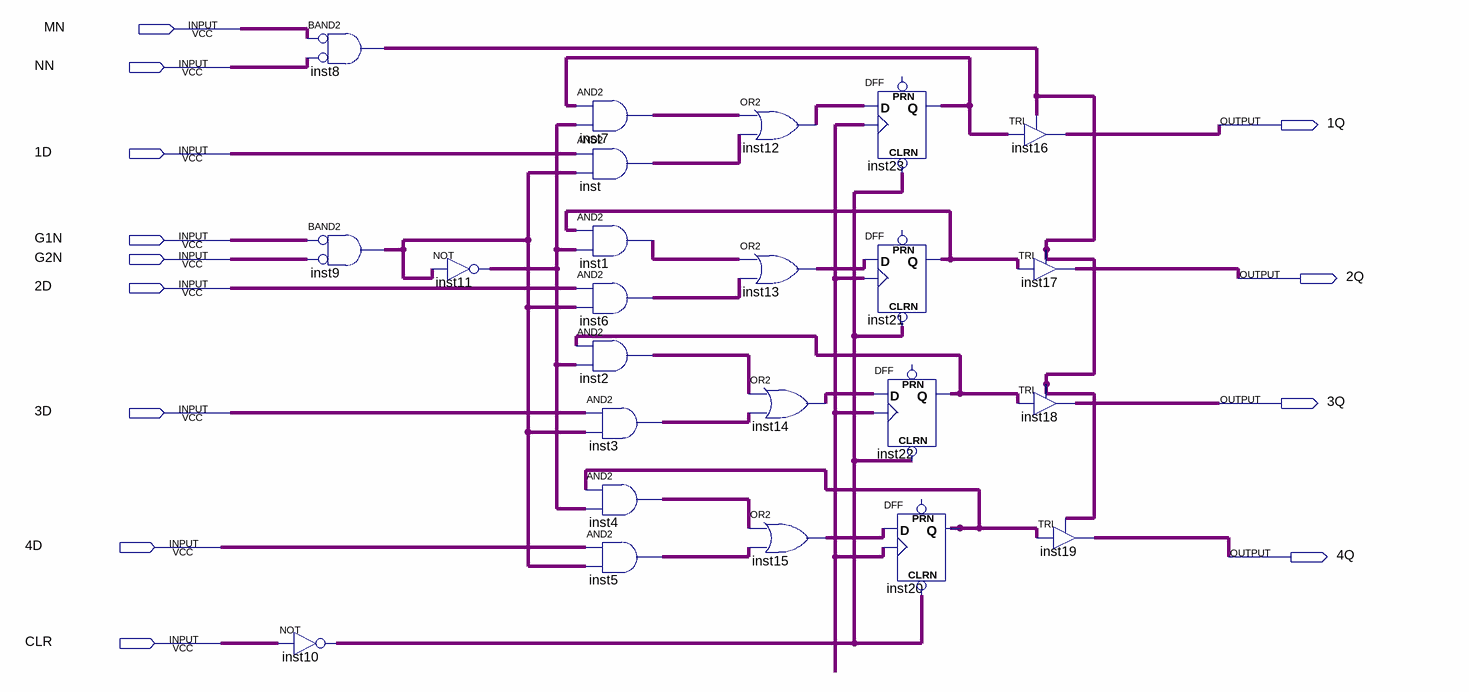
[diagram p0: schematic sheet]
// Quartus schematic Contador.bdf as structural Verilog: 24 symbols, 13 pins
module Contador (
  input  MN,
  input  NN,
  input  \1D ,
  input  G1N,
  input  G2N,
  input  \2D ,
  input  \3D ,
  input  \4D ,
  input  CLR,
  output \1Q ,
  output \2Q ,
  output \3Q ,
  output \4Q 
);

  wire inst1_out, inst2_out, inst3_out, inst4_out, inst5_out, inst6_out, inst7_out, inst8_out, inst9_out,
       inst10_out, inst11_out, inst12_out, inst13_out, inst14_out, inst15_out, inst20_q, inst21_q, inst22_q,
       inst23_q, inst_out, undriven;

  and inst8 (inst8_out, ~MN, ~NN);  // BAND2
  and inst9 (inst9_out, ~G1N, ~G2N);  // BAND2
  not inst10 (inst10_out, CLR);
  not inst11 (inst11_out, inst9_out);
  and inst7 (inst7_out, inst23_q, inst11_out);
  and inst (inst_out, \1D , inst9_out);
  and inst1 (inst1_out, inst21_q, inst11_out);
  and inst6 (inst6_out, \2D , inst9_out);
  and inst2 (inst2_out, inst22_q, inst11_out);
  and inst3 (inst3_out, \3D , inst9_out);
  and inst4 (inst4_out, inst20_q, inst11_out);
  and inst5 (inst5_out, \4D , inst9_out);
  or inst12 (inst12_out, inst7_out, inst_out);
  or inst13 (inst13_out, inst1_out, inst6_out);
  or inst14 (inst14_out, inst2_out, inst3_out);
  or inst15 (inst15_out, inst4_out, inst5_out);
  DFF inst23 (.CLRN(inst10_out), .CLK(undriven), .D(inst12_out), .Q(inst23_q));  // open: PRN
  DFF inst21 (.CLRN(inst10_out), .CLK(undriven), .D(inst13_out), .Q(inst21_q));  // open: PRN
  DFF inst22 (.CLRN(inst10_out), .CLK(undriven), .D(inst14_out), .Q(inst22_q));  // open: PRN
  DFF inst20 (.CLRN(inst10_out), .CLK(undriven), .D(inst15_out), .Q(inst20_q));  // open: PRN
  TRI inst16 (.IN(inst23_q), .OE(inst8_out), .OUT(\1Q ));
  TRI inst17 (.IN(inst21_q), .OE(inst8_out), .OUT(\2Q ));
  TRI inst18 (.IN(inst22_q), .OE(inst8_out), .OUT(\3Q ));
  TRI inst19 (.IN(inst20_q), .OE(inst8_out), .OUT(\4Q ));
endmodule
